# Altium project arduinoNano.PrjPcb
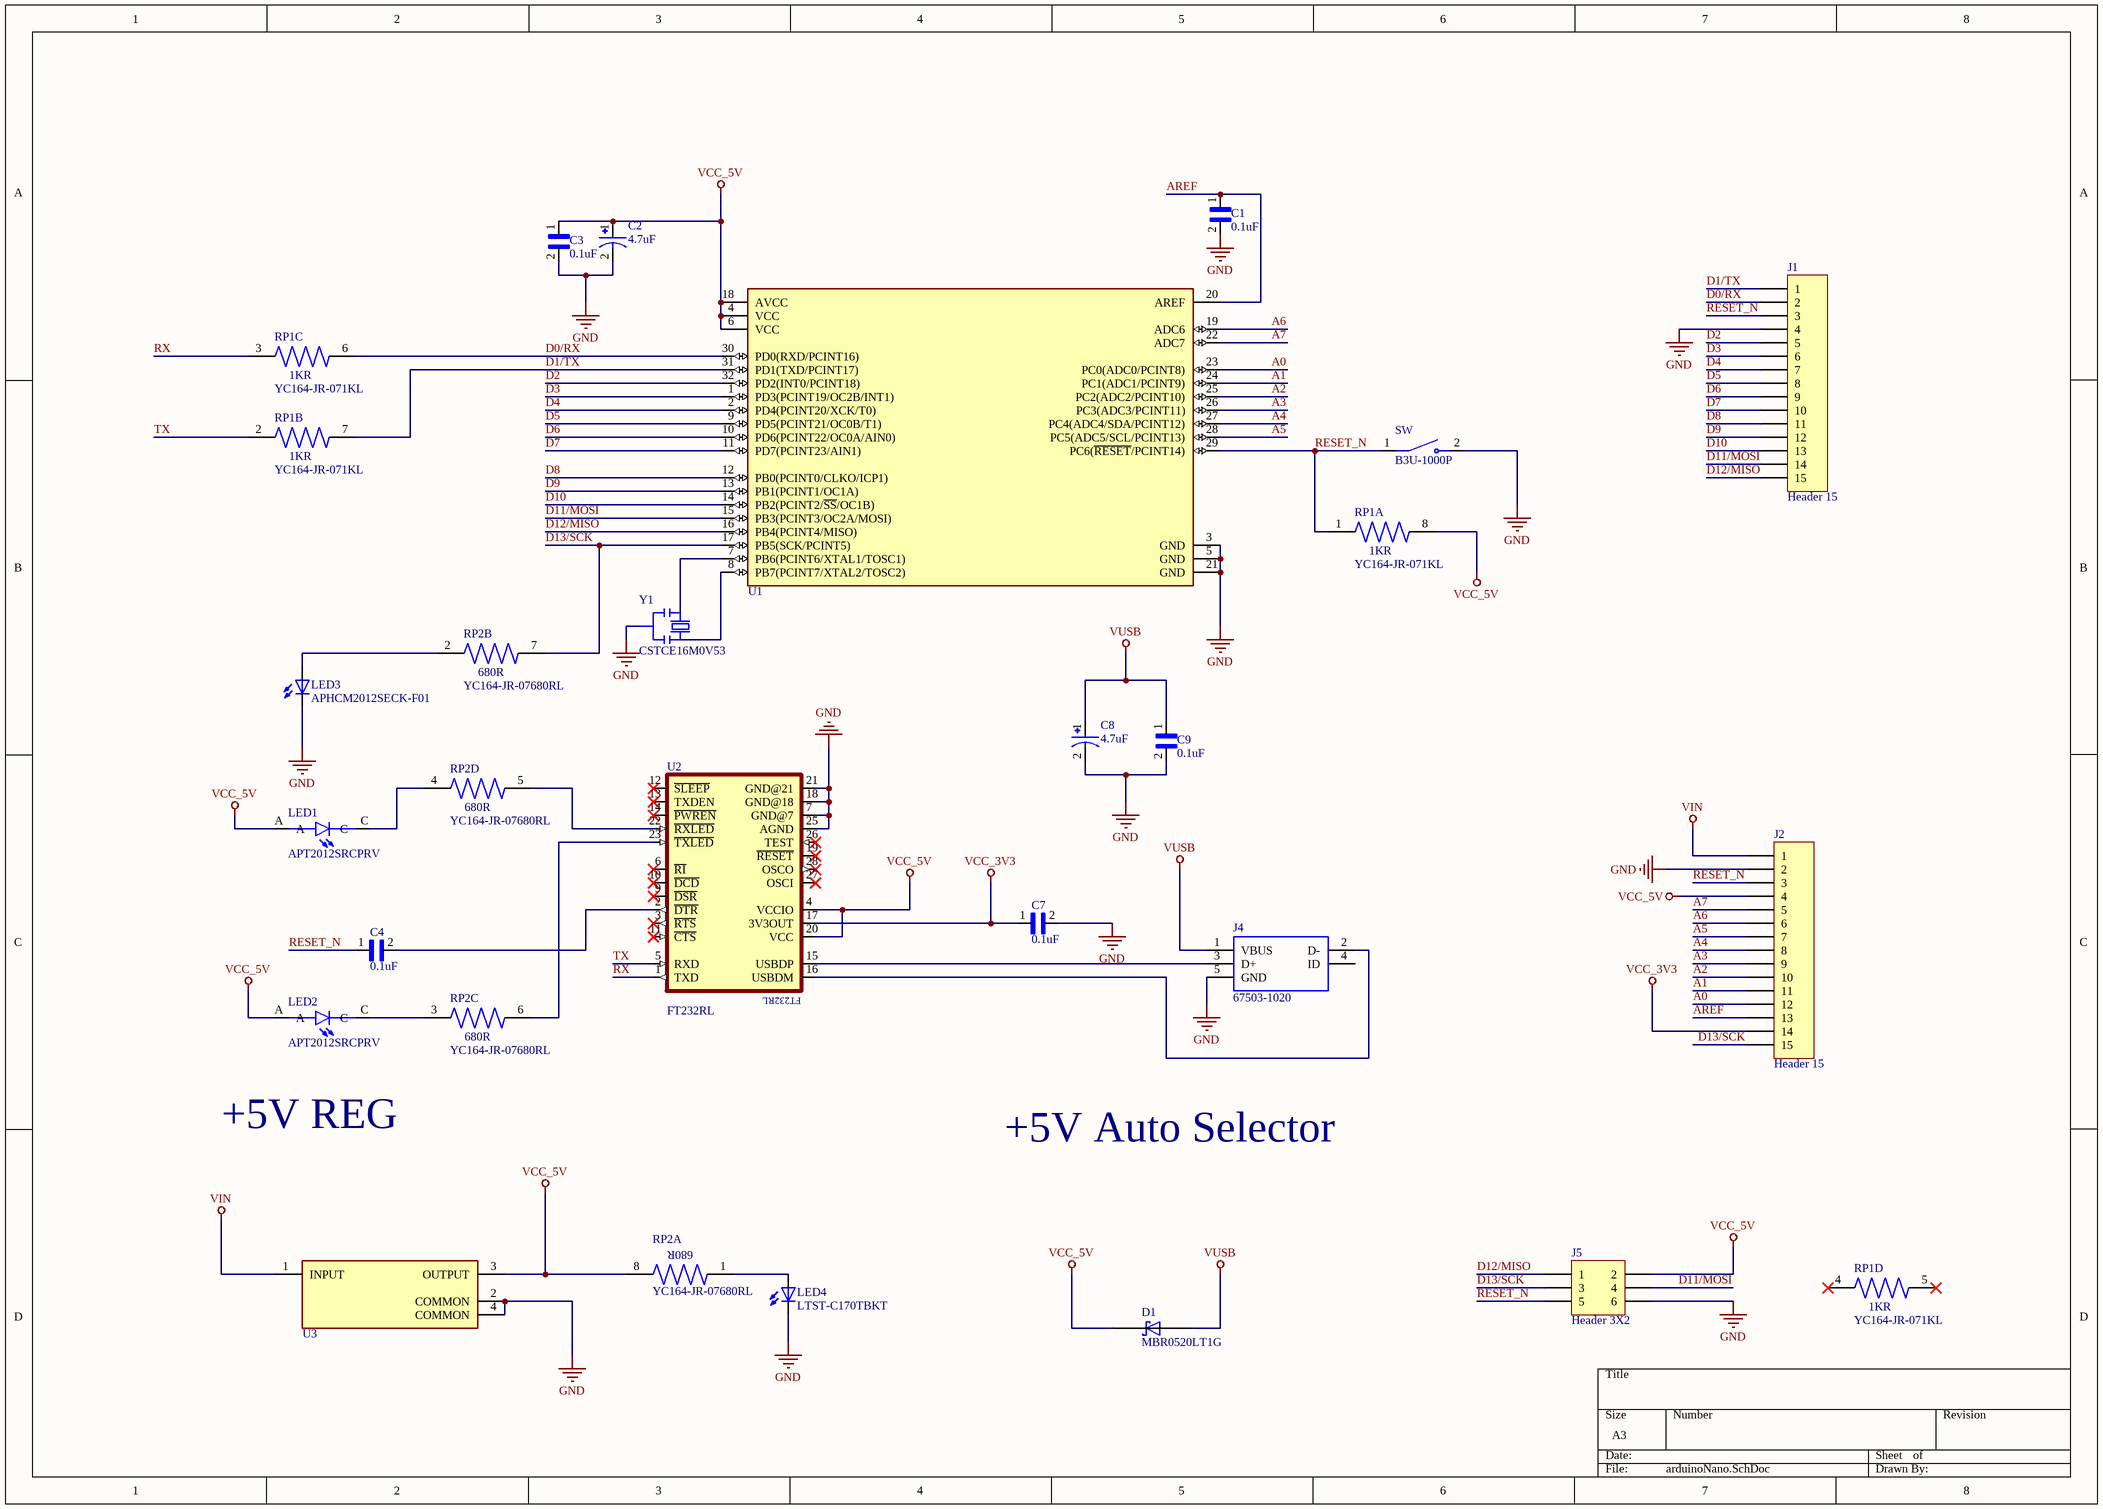
[diagram p0: arduinoNano.SchDoc]
1 sheet, 23 parts. Net scope: global (net labels, ports and power ports of the same name join across sheets).
Board file: arduinoNano.PcbDoc

## Sheet arduinoNano.SchDoc
size A3; SheetNumber: 1; SheetTotal: 1

### Parts
C1  value 0.1uF  [CAPC2012X88N]  (hidden comment: C0805C104K5RACTU)
C2  value 4.7uF  [CAPMP3216X180N]  (hidden comment: T491A475K010AT, 4.7uF)
C3  value 0.1uF  [CAPC2012X88N]  (hidden comment: C0805C104K5RACTU)
C4  value 0.1uF  [CAPC2012X88N]  (hidden comment: C0805C104K5RACTU)
C7  value 0.1uF  [CAPC2012X88N]  (hidden comment: C0805C104K5RACTU)
C8  value 4.7uF  [CAPMP3216X180N]  (hidden comment: T491A475K010AT, 4.7uF)
C9  value 0.1uF  [CAPC2012X88N]  (hidden comment: C0805C104K5RACTU)
D1  MBR0520LT1G  [SOD3716X117(SOD-123)]
J1  Header 15  [HDR1X15]
J2  Header 15  [HDR1X15]
J4  67503-1020  [67503-1020]
J5  Header 3X2  [HDR2X3]
LED1  APT2012SRCPRV  [LEDC2012X75N]
LED2  APT2012SRCPRV  [LEDC2012X75N]
LED3  APHCM2012SECK-F01  [DIOC200X125X110]
LED4  LTST-C170TBKT  [DIOC200X125X110]
RP1  YC164-JR-071KL  [RESCAXE80P320X160X70-8N]  (parts A,B,C,D of 4)
RP2  YC164-JR-07680RL  [RESCAXE80P320X160X70-8N]  (parts A,B,C,D of 4)
SW  B3U-1000P  [SW_B3U-1000P]
U1  ATMEGA168-20AU  [Microchip_32A_IPC_A]  (value not drawn)
U2  FT232RL  [SSOP28-0.65-10.2X5.2MM]
U3  UA78M05CDCYRG3  [Texas_Instruments_DCY0004A_IPC_A]  (value not drawn)
Y1  CSTCE16M0V53  [CSTCE16M0V53]

### Nets
GND: C1.2 C2.2 C3.2 C7.2 C8.2 C9.2 J1.4 J2.2 J4.5(GND) J5.6 LED3.NEG LED4.NEG SW.2 U1.3(GND) U1.5(GND) U1.21(GND) U2.7(GND@7) U2.18(GND@18) U2.21(GND@21) U2.25(AGND) U3.2(COMMON) U3.4(COMMON) Y1.2
VCC_3V3: C7.1 J2.14 U2.17(3V3OUT)
VCC_5V: C2.1 C3.1 D1.1(C) J2.4 J5.2 LED1.A LED2.A RP1.8 RP2.8 U1.4(VCC) U1.6(VCC) U1.18(AVCC) U2.4(VCCIO) U2.20(VCC) U3.3(OUTPUT)
VIN: J2.1 U3.1(INPUT)
VUSB: C8.1 C9.1 D1.2(A) J4.1(VBUS)
A0: J2.12 U1.23(PC0(ADC0/PCINT8))
A1: J2.11 U1.24(PC1(ADC1/PCINT9))
A2: J2.10 U1.25(PC2(ADC2/PCINT10))
A3: J2.9 U1.26(PC3(ADC3/PCINT11))
A4: J2.8 U1.27(PC4(ADC4/SDA/PCINT12))
A5: J2.7 U1.28(PC5(ADC5/SCL/PCINT13))
A6: J2.6 U1.19(ADC6)
A7: J2.5 U1.22(ADC7)
AREF: C1.1 J2.13 U1.20(AREF)
D0/RX: J1.2 RP1.6 U1.30(PD0(RXD/PCINT16))
D1/TX: J1.1 RP1.7 U1.31(PD1(TXD/PCINT17))
D2: J1.5 U1.32(PD2(INT0/PCINT18))
D3: J1.6 U1.1(PD3(PCINT19/OC2B/INT1))
D4: J1.7 U1.2(PD4(PCINT20/XCK/T0))
D5: J1.8 U1.9(PD5(PCINT21/OC0B/T1))
D6: J1.9 U1.10(PD6(PCINT22/OC0A/AIN0))
D7: J1.10 U1.11(PD7(PCINT23/AIN1))
D8: J1.11 U1.12(PB0(PCINT0/CLKO/ICP1))
D9: J1.12 U1.13(PB1(PCINT1/OC1A))
D10: J1.13 U1.14(PB2(PCINT2/~{SS}/OC1B))
D11/MOSI: J1.14 J5.4 U1.15(PB3(PCINT3/OC2A/MOSI))
D12/MISO: J1.15 J5.1 U1.16(PB4(PCINT4/MISO))
D13/SCK: J2.15 J5.3 RP2.7 U1.17(PB5(SCK/PCINT5))
RESET_N: C4.1 J1.3 J2.3 J5.5 RP1.1 SW.1 U1.29(PC6(~{RESET}/PCINT14))
RX: RP1.3 U2.1(TXD)
TX: RP1.2 U2.5(RXD)
NetC4_2: C4.2 U2.2(~{DTR})
NetJ4_2: J4.2(D-) U2.16(USBDM)
NetJ4_3: J4.3(D+) U2.15(USBDP)
NetLED1_C: LED1.C RP2.4
NetLED2_C: LED2.C RP2.3
NetLED3_POS: LED3.POS RP2.2
NetLED4_POS: LED4.POS RP2.1
NetRP2_5: RP2.5 U2.22(~{RXLED})
NetRP2_6: RP2.6 U2.23(~{TXLED})
NetU1_7: U1.7(PB6(PCINT6/XTAL1/TOSC1)) Y1.1
NetU1_8: U1.8(PB7(PCINT7/XTAL2/TOSC2)) Y1.3

Not connected (* = marked no-connect by the designer): J4 4(ID); RP1 4* 5*; U2 3(~{RTS})* 6(~{RI})* 9(~{DSR})* 10(~{DCD})* 11(~{CTS})* 12(~{SLEEP})* 13(TXDEN)* 14(~{PWREN})* 19(~{RESET})* 26(TEST)* 27(OSCI)* 28(OSCO)*

### Notes on the sheet
- +5V REG
- +5V Auto Selector
- (in symbol YC164-JR-071KL, part A) 1KR
- (in symbol YC164-JR-071KL, part B) 1KR
- (in symbol YC164-JR-071KL, part C) 1KR
- (in symbol YC164-JR-071KL, part D) 1KR
- (in symbol YC164-JR-07680RL, part A) 680R
- (in symbol YC164-JR-07680RL, part B) 680R
- (in symbol YC164-JR-07680RL, part C) 680R
- (in symbol YC164-JR-07680RL, part D) 680R

### Library data of the parts
C1 C3 C4 C7 C9 = C0805C104K5RACTU: SMD 0805 CERAMIC X7R -55^+125 100 NF +/-10? 50V; MF: {'manufacturer': u'KEMET'}; Price: None; Package: None; Availability: Unavailable; MP: C0805C104K5RACTU
C2 C8 = T491A475K010AT: 4.7ÂµF Molded Tantalum Capacitors 25V 1206 (3216 Metric) 6Ohm; MF: {'manufacturer': u'KEMET'}; Price: None; Package: None; Availability: Unavailable; MP: T491A475K010AT
D1 = MBR0520LT1G: Surface Mount Schottky Power Rectifier Plastic SODâˆ’123 Package; MF: {'manufacturer': u'ON Semiconductor'}; Value: *; Price: None; Package: None; Availability: Unavailable; MP: MBR0520LT1G
J1 J2 = Header 15: Header, 15-Pin; LatestRevisionDate: 17-Jul-2002; LatestRevisionNote: Re-released for DXP Platform.; Publisher: Altium Limited
J4 = 67503-1020: <b>0.8mm USB OTG Mini B SMT R/A Sol Tab Molex On-The-Go Series Right Angle SMT Version 2.0 Type B Mini USB Connector,  Receptacle, 30 V ac/dc, 1A</b><p> </b><br><a href="<br><a href="https://componentsearchengine.com/Images/3/67503-1020.jpg" title="Image"> <img src="https://componentsearchengine.com/Images/3/67503-1020.jpg" width="150"></a><p> Source: <a href="http://docs-europe.electrocomponents.com/webdocs/13c4/0900766b813c46de.pdf"> Datasheet </a>; MF: {'manufacturer': u'Molex'}; MP: 67503-1020; Package: None; Availability: Unavailable; Price: None; Value: *
J5 = Header 3X2: Header, 3-Pin, Dual row; LatestRevisionDate: 17-Jul-2002; LatestRevisionNote: Re-released for DXP Platform.; Publisher: Altium Limited
LED1 LED2 = APT2012SRCPRV: 2.0X1.2MM,RED SMD LED; MF: {'manufacturer': u'Kingbright'}; Value: *; Price: None; Package: None; Availability: Unavailable; MP: APT2012SRCPRV
LED3 LED4 = LTST-C170TBKT: Green 2 x 1.25 x 1.1 mm 130Â° Water Clear 35 mcd 2 V Surface Mount LED; MF: {'manufacturer': u'Lite-On Inc.'}; Price: None; Package: None; Availability: Unavailable; MP: LTST-C170TBKT; Value: *
RP1 = YC164-JR-071KL: Res Thick Film Array 100 Ohm 5% ?200ppm/C ISOL Epoxy 8-Pin 1206(4 X 0603) Convex SMD T/R
RP2 = YC164-JR-07680RL: Res Thick Film Array 100 Ohm 5% ?200ppm/C ISOL Epoxy 8-Pin 1206(4 X 0603) Convex SMD T/R
SW = B3U-1000P: Switch Tactile N.O. SPST Round Button Gull Wing 0.05A 12VDC 1.5N SMD Embossed T/R; MF: {'manufacturer': u'Omron'}; Value: *; Price: None; Package: None; Availability: Unavailable; MP: B3U-1000P
U2 = FT232RL: MF: {'manufacturer': u'FTDI, Future'}; Value: *; Price: None; Package: None; Availability: Unavailable; MP: FT232RL
Y1 = CSTCE16M0V53: <b>CSTCE16M0V53</b> Ceramic Resonator (CERALOCK) 16 MHz Chip Type; MF: {'manufacturer': u'Murata Electronics'}; MP: CSTCE16M0V53; Value: *; Price: None; Availability: Unavailable; Package: None